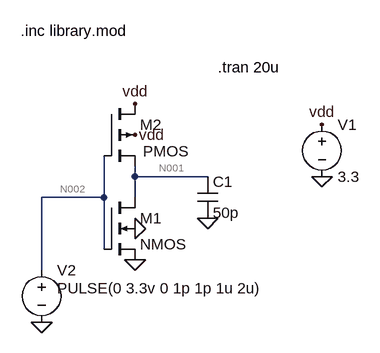
[diagram p0: schematic Draft4.asc]
Draft4.asc, the LTspice schematic file:
Version 4
SHEET 1 880 680
WIRE 192 272 192 256
WIRE 304 272 192 272
WIRE 144 304 144 240
WIRE 144 304 48 304
WIRE 192 304 192 272
WIRE 144 384 144 304
WIRE 48 416 48 304
FLAG 192 352 0
FLAG 192 400 0
FLAG 48 496 0
FLAG 480 272 0
FLAG 480 192 vdd
FLAG 192 160 vdd
FLAG 192 208 vdd
FLAG 304 336 0
SYMBOL voltage 480 176 R0
WINDOW 123 0 0 Left 0
WINDOW 39 0 0 Left 0
SYMATTR InstName V1
SYMATTR Value 3.3
SYMBOL voltage 48 400 R0
WINDOW 123 0 0 Left 0
WINDOW 39 0 0 Left 0
WINDOW 3 24 44 Left 2
SYMATTR InstName V2
SYMATTR Value PULSE(0 3.3v 0 1p 1p 1u 2u)
SYMBOL nmos4 144 304 R0
SYMATTR InstName M1
SYMATTR Value2 l=0.5u w=1u
SYMBOL pmos4 144 160 R0
WINDOW 3 60 73 Left 2
SYMATTR InstName M2
SYMATTR Value2 l=0.5u w=5u
SYMBOL cap 288 272 R0
SYMATTR InstName C1
SYMATTR Value 50p
TEXT 16 48 Left 2 !.inc library.mod
TEXT 320 104 Left 2 !.tran 20u

The netlist it stands for:
* Draft4.asc
V1 vdd 0 3.3
V2 N002 0 PULSE(0 3.3v 0 1p 1p 1u 2u)
M1 N001 N002 0 0 NMOS l=0.5u w=1u
M2 vdd N002 N001 vdd PMOS l=0.5u w=5u
C1 N001 0 50p
.model NMOS NMOS
.model PMOS PMOS
.lib standard.mos
.inc library.mod
.tran 20u
.backanno
.end

* Results of the author's LTspice run, read from the files saved beside the schematic
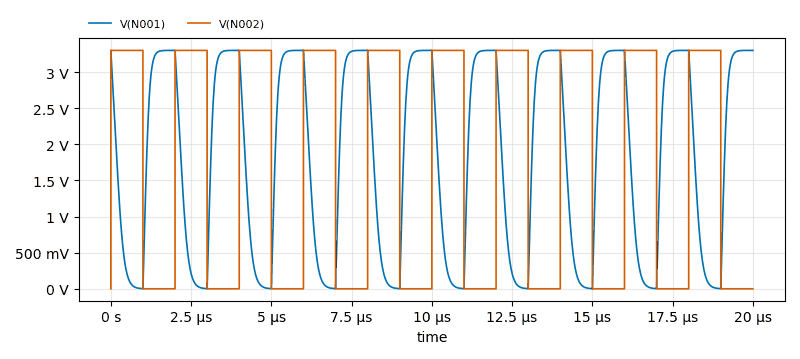
[diagram p1: Transient Analysis of Draft4.asc, plotted from the saved traces]
* Transient Analysis, 1 run:
*   V(N001): min 2.212 mV, max 3.3 V, average 1.823 V, rms 2.293 V, last 3.3 V
*   V(N002): min 0 V, max 3.3 V, average 1.65 V, rms 2.333 V, last 0 V